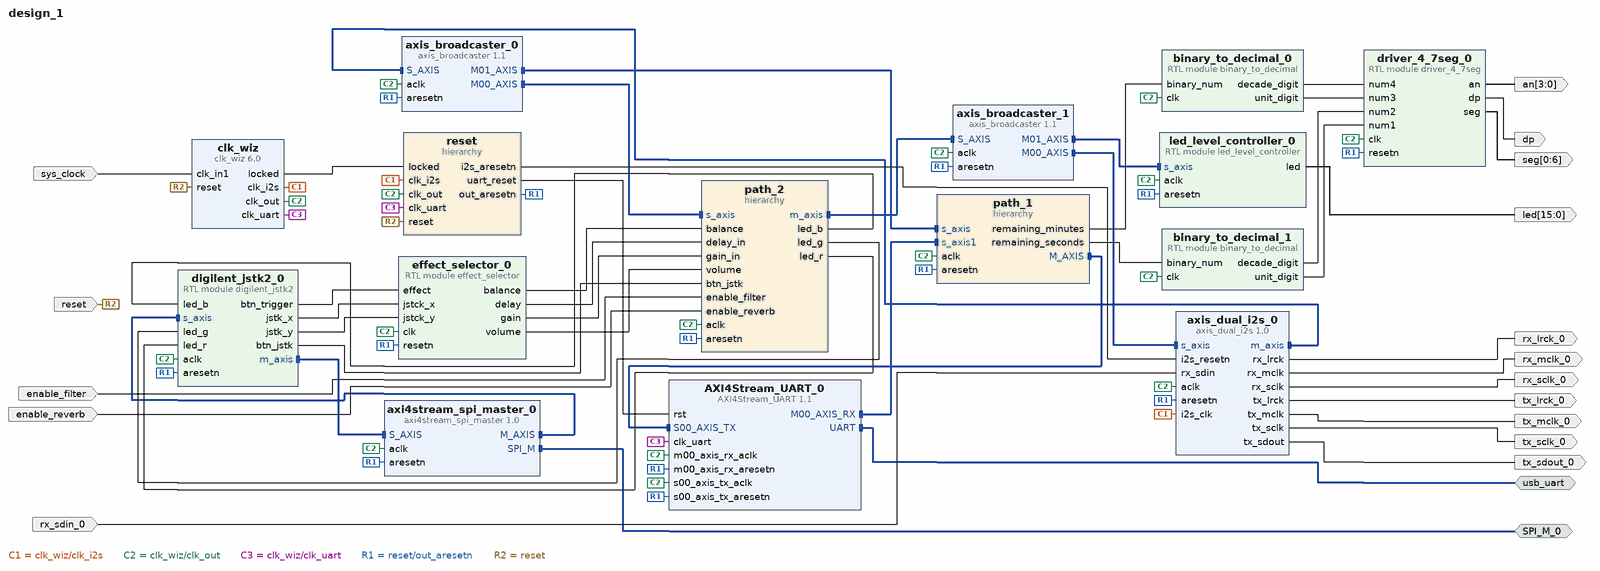
[diagram p0: block diagram of the top level]
# Vivado block design design_1, xc7a35tcpg236-1, Vivado 2020.2
create_bd_design design_1

create_bd_intf_port -mode Master -vlnv xilinx.com:interface:uart_rtl:1.0 usb_uart
create_bd_intf_port -mode Master -vlnv xilinx.com:interface:spi_rtl:1.0 SPI_M_0
create_bd_port -dir I enable_filter
create_bd_port -dir O -from 0 -to 6 seg
create_bd_port -dir O -from 3 -to 0 an
create_bd_port -dir O dp
create_bd_port -dir I enable_reverb
create_bd_port -dir O -from 15 -to 0 led
create_bd_port -dir O tx_lrck_0
create_bd_port -dir I rx_sdin_0
create_bd_port -dir O rx_sclk_0
create_bd_port -dir O rx_lrck_0
create_bd_port -dir O rx_mclk_0
create_bd_port -dir O tx_sdout_0
create_bd_port -dir O tx_sclk_0
create_bd_port -dir O tx_mclk_0
create_bd_port -dir I -type clk sys_clock
set_property -dict {CONFIG.FREQ_HZ 100000000 CONFIG.PHASE 0.000} [get_bd_ports sys_clock]
create_bd_port -dir I -type rst reset
set_property -dict {CONFIG.POLARITY ACTIVE_HIGH} [get_bd_ports reset]

create_bd_cell -type ip -vlnv DigiLAB:ip:axis_dual_i2s:1.0 axis_dual_i2s_0
create_bd_cell -type ip -vlnv xilinx.com:ip:axis_broadcaster:1.1 axis_broadcaster_1
set_property -dict [list \
  CONFIG.HAS_TKEEP 0 \
  CONFIG.HAS_TLAST 1 \
  CONFIG.HAS_TREADY 1 \
  CONFIG.HAS_TSTRB 0 \
  CONFIG.M_TDATA_NUM_BYTES 3 \
  CONFIG.M_TUSER_WIDTH 0 \
  CONFIG.S_TDATA_NUM_BYTES 3 \
  CONFIG.S_TUSER_WIDTH 0 \
  CONFIG.TDEST_WIDTH 0 \
  CONFIG.TID_WIDTH 0 \
] [get_bd_cells axis_broadcaster_1]
create_bd_cell -type module -reference led_level_controller led_level_controller_0
set_property -dict {CONFIG.clock_period_ns 5} [get_bd_cells led_level_controller_0]
create_bd_cell -type module -reference digilent_jstk2 digilent_jstk2_0
set_property -dict {CONFIG.CLKFREQ 200000000 CONFIG.SPI_SCLKFREQ 5000} [get_bd_cells digilent_jstk2_0]
create_bd_cell -type ip -vlnv DigiLAB:ip:axi4stream_spi_master:1.0 axi4stream_spi_master_0
set_property -dict {CONFIG.c_clkfreq 200000000 CONFIG.c_sclkfreq 5000} [get_bd_cells axi4stream_spi_master_0]
create_bd_cell -type module -reference effect_selector effect_selector_0
create_bd_cell -type module -reference driver_4_7seg driver_4_7seg_0
set_property -dict {CONFIG.clock_period_ns 5} [get_bd_cells driver_4_7seg_0]
create_bd_cell -type ip -vlnv xilinx.com:ip:axis_broadcaster:1.1 axis_broadcaster_0
set_property -dict [list \
  CONFIG.HAS_TKEEP 0 \
  CONFIG.HAS_TLAST 1 \
  CONFIG.HAS_TREADY 1 \
  CONFIG.HAS_TSTRB 0 \
  CONFIG.M_TDATA_NUM_BYTES 3 \
  CONFIG.M_TUSER_WIDTH 0 \
  CONFIG.S_TDATA_NUM_BYTES 3 \
  CONFIG.S_TUSER_WIDTH 0 \
  CONFIG.TDEST_WIDTH 0 \
  CONFIG.TID_WIDTH 0 \
] [get_bd_cells axis_broadcaster_0]
create_bd_cell -type hier path_2
create_bd_cell -type hier path_1
create_bd_cell -type hier reset
create_bd_cell -type ip -vlnv DigiLAB:ip:AXI4Stream_UART:1.1 AXI4Stream_UART_0
set_property -dict [list \
  CONFIG.UART_BAUD_RATE 2000000 \
  CONFIG.UART_BOARD_INTERFACE usb_uart \
  CONFIG.USE_BOARD_FLOW true \
] [get_bd_cells AXI4Stream_UART_0]
create_bd_cell -type module -reference binary_to_decimal binary_to_decimal_0
create_bd_cell -type ip -vlnv xilinx.com:ip:clk_wiz:6.0 clk_wiz
set_property -dict [list \
  CONFIG.CLKOUT1_DRIVES BUFG \
  CONFIG.CLKOUT1_JITTER 143.752 \
  CONFIG.CLKOUT1_PHASE_ERROR 98.575 \
  CONFIG.CLKOUT1_REQUESTED_OUT_FREQ 64 \
  CONFIG.CLKOUT2_DRIVES BUFG \
  CONFIG.CLKOUT2_JITTER 178.715 \
  CONFIG.CLKOUT2_PHASE_ERROR 98.575 \
  CONFIG.CLKOUT2_REQUESTED_OUT_FREQ 22.579 \
  CONFIG.CLKOUT2_USED true \
  CONFIG.CLKOUT3_DRIVES BUFG \
  CONFIG.CLKOUT3_JITTER 114.829 \
  CONFIG.CLKOUT3_PHASE_ERROR 98.575 \
  CONFIG.CLKOUT3_REQUESTED_OUT_FREQ 200 \
  CONFIG.CLKOUT3_USED true \
  CONFIG.CLKOUT4_DRIVES BUFG \
  CONFIG.CLKOUT5_DRIVES BUFG \
  CONFIG.CLKOUT6_DRIVES BUFG \
  CONFIG.CLKOUT7_DRIVES BUFG \
  CONFIG.CLK_IN1_BOARD_INTERFACE sys_clock \
  CONFIG.CLK_OUT1_PORT clk_uart \
  CONFIG.CLK_OUT2_PORT clk_i2s \
  CONFIG.CLK_OUT3_PORT clk_out \
  CONFIG.FEEDBACK_SOURCE FDBK_AUTO \
  CONFIG.MMCM_BANDWIDTH OPTIMIZED \
  CONFIG.MMCM_CLKFBOUT_MULT_F 10.000 \
  CONFIG.MMCM_CLKOUT0_DIVIDE_F 15.625 \
  CONFIG.MMCM_CLKOUT1_DIVIDE 44 \
  CONFIG.MMCM_CLKOUT2_DIVIDE 5 \
  CONFIG.MMCM_COMPENSATION ZHOLD \
  CONFIG.MMCM_DIVCLK_DIVIDE 1 \
  CONFIG.NUM_OUT_CLKS 3 \
  CONFIG.PRIMITIVE MMCM \
  CONFIG.PRIM_IN_FREQ 100.000 \
  CONFIG.RESET_BOARD_INTERFACE reset \
  CONFIG.USE_BOARD_FLOW true \
] [get_bd_cells clk_wiz]
create_bd_cell -type module -reference binary_to_decimal binary_to_decimal_1

# ---- hierarchy /path_2 ----
current_bd_instance /path_2
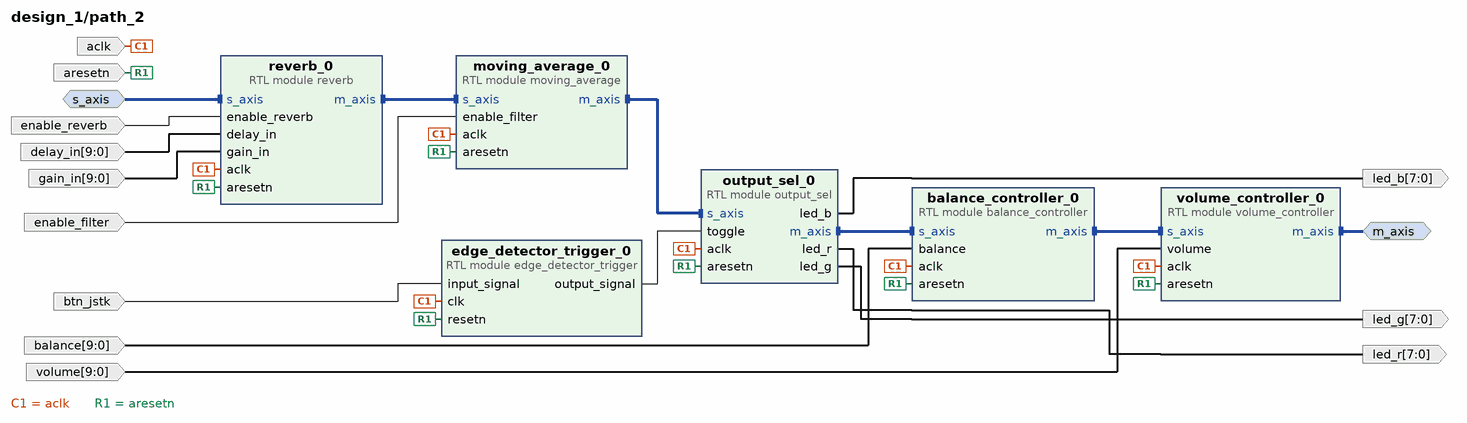
[diagram p1: block diagram inside /path_2]
create_bd_intf_pin -mode Slave -vlnv xilinx.com:interface:axis_rtl:1.0 s_axis
create_bd_intf_pin -mode Master -vlnv xilinx.com:interface:axis_rtl:1.0 m_axis
create_bd_pin -dir I enable_filter
create_bd_pin -dir I -type clk aclk
create_bd_pin -dir I -type rst aresetn
create_bd_pin -dir O -from 7 -to 0 led_r
create_bd_pin -dir O -from 7 -to 0 led_g
create_bd_pin -dir O -from 7 -to 0 led_b
create_bd_pin -dir I enable_reverb
create_bd_pin -dir I -from 9 -to 0 delay_in
create_bd_pin -dir I -from 9 -to 0 gain_in
create_bd_pin -dir I -from 9 -to 0 balance
create_bd_pin -dir I -from 9 -to 0 volume
create_bd_pin -dir I btn_jstk

create_bd_cell -type module -reference moving_average moving_average_0
create_bd_cell -type module -reference balance_controller balance_controller_0
create_bd_cell -type module -reference volume_controller volume_controller_0
set_property -dict {CONFIG.LOWER_BOUND -8388608} [get_bd_cells volume_controller_0]
create_bd_cell -type module -reference edge_detector_trigger edge_detector_trigger_0
create_bd_cell -type module -reference output_sel output_sel_0
set_property -dict {CONFIG.LOWER_BOUND -8388608} [get_bd_cells output_sel_0]
create_bd_cell -type module -reference reverb reverb_0
set_property -dict {CONFIG.LOG2_DELAY_INCR 4 CONFIG.LOWER_BOUND -8388608} [get_bd_cells reverb_0]

# ---- hierarchy /path_1 ----
current_bd_instance /path_1
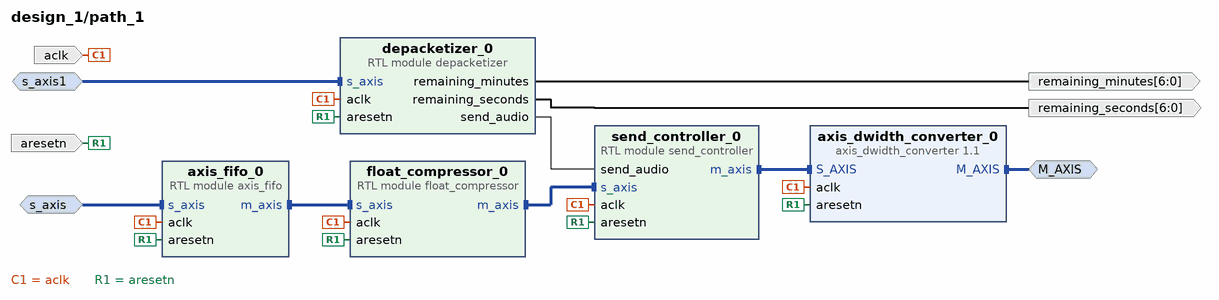
[diagram p2: block diagram inside /path_1]
create_bd_intf_pin -mode Master -vlnv xilinx.com:interface:axis_rtl:1.0 M_AXIS
create_bd_intf_pin -mode Slave -vlnv xilinx.com:interface:axis_rtl:1.0 s_axis
create_bd_intf_pin -mode Slave -vlnv xilinx.com:interface:axis_rtl:1.0 s_axis1
create_bd_pin -dir I -type clk aclk
create_bd_pin -dir I -type rst aresetn
create_bd_pin -dir O -from 6 -to 0 remaining_minutes
create_bd_pin -dir O -from 6 -to 0 remaining_seconds

create_bd_cell -type module -reference float_compressor float_compressor_0
create_bd_cell -type ip -vlnv xilinx.com:ip:axis_dwidth_converter:1.1 axis_dwidth_converter_0
set_property -dict {CONFIG.M_TDATA_NUM_BYTES 1} [get_bd_cells axis_dwidth_converter_0]
create_bd_cell -type module -reference axis_fifo axis_fifo_0
create_bd_cell -type module -reference depacketizer depacketizer_0
set_property -dict {CONFIG.CLK_FREQ_HZ 200000000} [get_bd_cells depacketizer_0]
create_bd_cell -type module -reference send_controller send_controller_0

# ---- hierarchy /reset ----
current_bd_instance /reset
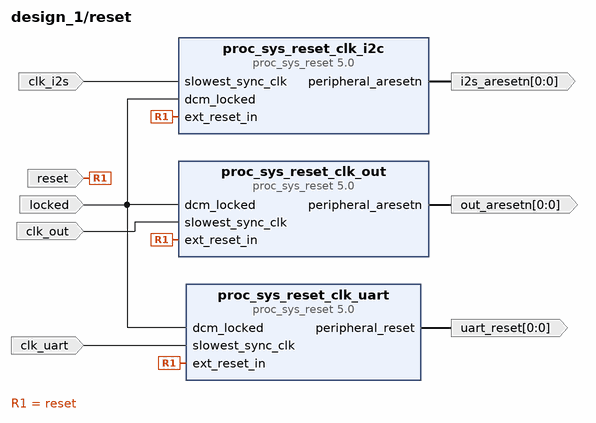
[diagram p3: block diagram inside /reset]
create_bd_pin -dir I -type clk clk_i2s
create_bd_pin -dir I -type rst reset
create_bd_pin -dir I locked
create_bd_pin -dir O -from 0 -to 0 -type rst i2s_aresetn
create_bd_pin -dir I -type clk clk_uart
create_bd_pin -dir O -from 0 -to 0 -type rst uart_reset
create_bd_pin -dir I -type clk clk_out
create_bd_pin -dir O -from 0 -to 0 -type rst out_aresetn

create_bd_cell -type ip -vlnv xilinx.com:ip:proc_sys_reset:5.0 proc_sys_reset_clk_uart
set_property -dict {CONFIG.RESET_BOARD_INTERFACE Custom CONFIG.USE_BOARD_FLOW false} [get_bd_cells proc_sys_reset_clk_uart]
create_bd_cell -type ip -vlnv xilinx.com:ip:proc_sys_reset:5.0 proc_sys_reset_clk_out
set_property -dict {CONFIG.RESET_BOARD_INTERFACE Custom CONFIG.USE_BOARD_FLOW false} [get_bd_cells proc_sys_reset_clk_out]
create_bd_cell -type ip -vlnv xilinx.com:ip:proc_sys_reset:5.0 proc_sys_reset_clk_i2c
set_property -dict {CONFIG.RESET_BOARD_INTERFACE Custom CONFIG.USE_BOARD_FLOW false} [get_bd_cells proc_sys_reset_clk_i2c]

# ---- connections ----

current_bd_instance /path_2
connect_bd_intf_net [get_bd_intf_pins balance_controller_0/m_axis] [get_bd_intf_pins volume_controller_0/s_axis]
connect_bd_intf_net [get_bd_intf_pins m_axis] [get_bd_intf_pins volume_controller_0/m_axis]
connect_bd_intf_net [get_bd_intf_pins reverb_0/m_axis] [get_bd_intf_pins moving_average_0/s_axis]
connect_bd_intf_net -intf_net split_M00_AXIS [get_bd_intf_pins s_axis] [get_bd_intf_pins reverb_0/s_axis]
connect_bd_intf_net [get_bd_intf_pins moving_average_0/m_axis] [get_bd_intf_pins output_sel_0/s_axis]
connect_bd_intf_net [get_bd_intf_pins output_sel_0/m_axis] [get_bd_intf_pins balance_controller_0/s_axis]
connect_bd_net [get_bd_pins enable_filter] [get_bd_pins moving_average_0/enable_filter]
connect_bd_net -net clk_wiz_clk_out [get_bd_pins aclk] \
  [get_bd_pins volume_controller_0/aclk] [get_bd_pins balance_controller_0/aclk] [get_bd_pins moving_average_0/aclk] \
  [get_bd_pins edge_detector_trigger_0/clk] [get_bd_pins output_sel_0/aclk] [get_bd_pins reverb_0/aclk]
connect_bd_net -net proc_sys_reset_1_peripheral_aresetn [get_bd_pins aresetn] \
  [get_bd_pins volume_controller_0/aresetn] [get_bd_pins balance_controller_0/aresetn] [get_bd_pins moving_average_0/aresetn] \
  [get_bd_pins edge_detector_trigger_0/resetn] [get_bd_pins output_sel_0/aresetn] [get_bd_pins reverb_0/aresetn]
connect_bd_net [get_bd_pins output_sel_0/led_r] [get_bd_pins led_r]
connect_bd_net [get_bd_pins output_sel_0/led_g] [get_bd_pins led_g]
connect_bd_net [get_bd_pins output_sel_0/led_b] [get_bd_pins led_b]
connect_bd_net -net enable_reverb_0_1 [get_bd_pins enable_reverb] [get_bd_pins reverb_0/enable_reverb]
connect_bd_net -net effect_selector_0_delay [get_bd_pins delay_in] [get_bd_pins reverb_0/delay_in]
connect_bd_net -net effect_selector_0_gain [get_bd_pins gain_in] [get_bd_pins reverb_0/gain_in]
connect_bd_net -net effect_selector_0_balance [get_bd_pins balance] [get_bd_pins balance_controller_0/balance]
connect_bd_net -net effect_selector_0_volume [get_bd_pins volume] [get_bd_pins volume_controller_0/volume]
connect_bd_net [get_bd_pins edge_detector_trigger_0/output_signal] [get_bd_pins output_sel_0/toggle]
connect_bd_net -net input_signal_1 [get_bd_pins btn_jstk] [get_bd_pins edge_detector_trigger_0/input_signal]

current_bd_instance /path_1
connect_bd_intf_net [get_bd_intf_pins float_compressor_0/m_axis] [get_bd_intf_pins send_controller_0/s_axis]
connect_bd_intf_net [get_bd_intf_pins send_controller_0/m_axis] [get_bd_intf_pins axis_dwidth_converter_0/S_AXIS]
connect_bd_intf_net -intf_net split_m_axis [get_bd_intf_pins float_compressor_0/s_axis] [get_bd_intf_pins axis_fifo_0/m_axis]
connect_bd_intf_net -intf_net axis_broadcaster_0_M01_AXIS [get_bd_intf_pins s_axis] [get_bd_intf_pins axis_fifo_0/s_axis]
connect_bd_intf_net -intf_net AXI4Stream_UART_0_M00_AXIS_RX [get_bd_intf_pins s_axis1] [get_bd_intf_pins depacketizer_0/s_axis]
connect_bd_intf_net [get_bd_intf_pins M_AXIS] [get_bd_intf_pins axis_dwidth_converter_0/M_AXIS]
connect_bd_net [get_bd_pins depacketizer_0/send_audio] [get_bd_pins send_controller_0/send_audio]
connect_bd_net -net clk_wiz_clk_out [get_bd_pins aclk] \
  [get_bd_pins axis_dwidth_converter_0/aclk] [get_bd_pins axis_fifo_0/aclk] [get_bd_pins float_compressor_0/aclk] \
  [get_bd_pins depacketizer_0/aclk] [get_bd_pins send_controller_0/aclk]
connect_bd_net -net proc_sys_reset_1_peripheral_aresetn [get_bd_pins aresetn] \
  [get_bd_pins axis_dwidth_converter_0/aresetn] [get_bd_pins axis_fifo_0/aresetn] [get_bd_pins float_compressor_0/aresetn] \
  [get_bd_pins depacketizer_0/aresetn] [get_bd_pins send_controller_0/aresetn]
connect_bd_net [get_bd_pins depacketizer_0/remaining_minutes] [get_bd_pins remaining_minutes]
connect_bd_net [get_bd_pins depacketizer_0/remaining_seconds] [get_bd_pins remaining_seconds]

current_bd_instance /reset
connect_bd_net -net clk_wiz_clk_i2s [get_bd_pins clk_i2s] [get_bd_pins proc_sys_reset_clk_i2c/slowest_sync_clk]
connect_bd_net [get_bd_pins reset] \
  [get_bd_pins proc_sys_reset_clk_uart/ext_reset_in] [get_bd_pins proc_sys_reset_clk_out/ext_reset_in] \
  [get_bd_pins proc_sys_reset_clk_i2c/ext_reset_in]
connect_bd_net -net clk_wiz_locked [get_bd_pins locked] \
  [get_bd_pins proc_sys_reset_clk_uart/dcm_locked] [get_bd_pins proc_sys_reset_clk_out/dcm_locked] \
  [get_bd_pins proc_sys_reset_clk_i2c/dcm_locked]
connect_bd_net -net proc_sys_reset_2_peripheral_aresetn [get_bd_pins proc_sys_reset_clk_i2c/peripheral_aresetn] [get_bd_pins i2s_aresetn]
connect_bd_net -net clk_wiz_clk_uart [get_bd_pins clk_uart] [get_bd_pins proc_sys_reset_clk_uart/slowest_sync_clk]
connect_bd_net -net proc_sys_reset_0_peripheral_reset [get_bd_pins proc_sys_reset_clk_uart/peripheral_reset] [get_bd_pins uart_reset]
connect_bd_net -net clk_wiz_clk_out [get_bd_pins clk_out] [get_bd_pins proc_sys_reset_clk_out/slowest_sync_clk]
connect_bd_net -net proc_sys_reset_1_peripheral_aresetn [get_bd_pins proc_sys_reset_clk_out/peripheral_aresetn] [get_bd_pins out_aresetn]

current_bd_instance /
connect_bd_intf_net -intf_net axis_dwidth_converter_0_M_AXIS [get_bd_intf_pins path_1/M_AXIS] [get_bd_intf_pins AXI4Stream_UART_0/S00_AXIS_TX]
connect_bd_intf_net [get_bd_intf_pins path_1/s_axis] [get_bd_intf_pins axis_broadcaster_0/M01_AXIS]
connect_bd_intf_net [get_bd_intf_pins axis_dual_i2s_0/m_axis] [get_bd_intf_pins axis_broadcaster_0/S_AXIS]
connect_bd_intf_net -intf_net split_M00_AXIS [get_bd_intf_pins path_2/s_axis] [get_bd_intf_pins axis_broadcaster_0/M00_AXIS]
connect_bd_intf_net -intf_net volume_controller_0_m_axis [get_bd_intf_pins path_2/m_axis] [get_bd_intf_pins axis_broadcaster_1/S_AXIS]
connect_bd_intf_net [get_bd_intf_pins axi4stream_spi_master_0/M_AXIS] [get_bd_intf_pins digilent_jstk2_0/s_axis]
connect_bd_intf_net [get_bd_intf_ports usb_uart] [get_bd_intf_pins AXI4Stream_UART_0/UART]
connect_bd_intf_net [get_bd_intf_pins AXI4Stream_UART_0/M00_AXIS_RX] [get_bd_intf_pins path_1/s_axis1]
connect_bd_intf_net [get_bd_intf_pins axis_broadcaster_1/M01_AXIS] [get_bd_intf_pins led_level_controller_0/s_axis]
connect_bd_intf_net [get_bd_intf_pins axi4stream_spi_master_0/S_AXIS] [get_bd_intf_pins digilent_jstk2_0/m_axis]
connect_bd_intf_net -intf_net axis_broadcaster_1_M01_AXIS [get_bd_intf_pins axis_dual_i2s_0/s_axis] [get_bd_intf_pins axis_broadcaster_1/M00_AXIS]
connect_bd_intf_net [get_bd_intf_ports SPI_M_0] [get_bd_intf_pins axi4stream_spi_master_0/SPI_M]
connect_bd_net [get_bd_pins axis_dual_i2s_0/rx_lrck] [get_bd_ports rx_lrck_0]
connect_bd_net [get_bd_pins axis_dual_i2s_0/rx_mclk] [get_bd_ports rx_mclk_0]
connect_bd_net [get_bd_pins axis_dual_i2s_0/rx_sclk] [get_bd_ports rx_sclk_0]
connect_bd_net [get_bd_pins axis_dual_i2s_0/tx_lrck] [get_bd_ports tx_lrck_0]
connect_bd_net [get_bd_pins axis_dual_i2s_0/tx_mclk] [get_bd_ports tx_mclk_0]
connect_bd_net [get_bd_pins axis_dual_i2s_0/tx_sclk] [get_bd_ports tx_sclk_0]
connect_bd_net [get_bd_pins axis_dual_i2s_0/tx_sdout] [get_bd_ports tx_sdout_0]
connect_bd_net [get_bd_pins binary_to_decimal_0/decade_digit] [get_bd_pins driver_4_7seg_0/num4]
connect_bd_net [get_bd_pins binary_to_decimal_0/unit_digit] [get_bd_pins driver_4_7seg_0/num3]
connect_bd_net [get_bd_pins binary_to_decimal_1/decade_digit] [get_bd_pins driver_4_7seg_0/num2]
connect_bd_net [get_bd_pins binary_to_decimal_1/unit_digit] [get_bd_pins driver_4_7seg_0/num1]
connect_bd_net [get_bd_pins clk_wiz/clk_i2s] [get_bd_pins axis_dual_i2s_0/i2s_clk] [get_bd_pins reset/clk_i2s]
connect_bd_net [get_bd_pins clk_wiz/clk_out] \
  [get_bd_pins axis_dual_i2s_0/aclk] [get_bd_pins axis_broadcaster_1/aclk] [get_bd_pins led_level_controller_0/aclk] \
  [get_bd_pins digilent_jstk2_0/aclk] [get_bd_pins axi4stream_spi_master_0/aclk] [get_bd_pins effect_selector_0/clk] \
  [get_bd_pins driver_4_7seg_0/clk] [get_bd_pins axis_broadcaster_0/aclk] [get_bd_pins path_2/aclk] [get_bd_pins path_1/aclk] \
  [get_bd_pins reset/clk_out] [get_bd_pins AXI4Stream_UART_0/m00_axis_rx_aclk] \
  [get_bd_pins AXI4Stream_UART_0/s00_axis_tx_aclk] [get_bd_pins binary_to_decimal_0/clk] \
  [get_bd_pins binary_to_decimal_1/clk]
connect_bd_net [get_bd_pins clk_wiz/clk_uart] [get_bd_pins reset/clk_uart] [get_bd_pins AXI4Stream_UART_0/clk_uart]
connect_bd_net [get_bd_pins clk_wiz/locked] [get_bd_pins reset/locked]
connect_bd_net -net depacketizer_0_remaining_minutes [get_bd_pins path_1/remaining_minutes] [get_bd_pins binary_to_decimal_0/binary_num]
connect_bd_net -net depacketizer_0_remaining_seconds [get_bd_pins path_1/remaining_seconds] [get_bd_pins binary_to_decimal_1/binary_num]
connect_bd_net [get_bd_pins digilent_jstk2_0/btn_trigger] [get_bd_pins effect_selector_0/effect]
connect_bd_net [get_bd_pins digilent_jstk2_0/jstk_x] [get_bd_pins effect_selector_0/jstck_x]
connect_bd_net [get_bd_pins digilent_jstk2_0/jstk_y] [get_bd_pins effect_selector_0/jstck_y]
connect_bd_net [get_bd_pins driver_4_7seg_0/an] [get_bd_ports an]
connect_bd_net [get_bd_pins driver_4_7seg_0/dp] [get_bd_ports dp]
connect_bd_net [get_bd_pins driver_4_7seg_0/seg] [get_bd_ports seg]
connect_bd_net [get_bd_pins effect_selector_0/balance] [get_bd_pins path_2/balance]
connect_bd_net [get_bd_pins effect_selector_0/delay] [get_bd_pins path_2/delay_in]
connect_bd_net [get_bd_pins effect_selector_0/gain] [get_bd_pins path_2/gain_in]
connect_bd_net [get_bd_pins effect_selector_0/volume] [get_bd_pins path_2/volume]
connect_bd_net [get_bd_ports enable_filter] [get_bd_pins path_2/enable_filter]
connect_bd_net -net enable_reverb_0_1 [get_bd_ports enable_reverb] [get_bd_pins path_2/enable_reverb]
connect_bd_net [get_bd_pins led_level_controller_0/led] [get_bd_ports led]
connect_bd_net -net output_sel_0_led_b [get_bd_pins path_2/led_b] [get_bd_pins digilent_jstk2_0/led_b]
connect_bd_net -net output_sel_0_led_g [get_bd_pins path_2/led_g] [get_bd_pins digilent_jstk2_0/led_g]
connect_bd_net -net output_sel_0_led_r [get_bd_pins path_2/led_r] [get_bd_pins digilent_jstk2_0/led_r]
connect_bd_net -net proc_sys_reset_0_peripheral_reset [get_bd_pins reset/uart_reset] [get_bd_pins AXI4Stream_UART_0/rst]
connect_bd_net -net proc_sys_reset_1_peripheral_aresetn [get_bd_pins reset/out_aresetn] \
  [get_bd_pins axis_dual_i2s_0/aresetn] [get_bd_pins axis_broadcaster_1/aresetn] [get_bd_pins led_level_controller_0/aresetn] \
  [get_bd_pins digilent_jstk2_0/aresetn] [get_bd_pins axi4stream_spi_master_0/aresetn] [get_bd_pins effect_selector_0/resetn] \
  [get_bd_pins driver_4_7seg_0/resetn] [get_bd_pins axis_broadcaster_0/aresetn] [get_bd_pins path_2/aresetn] \
  [get_bd_pins path_1/aresetn] [get_bd_pins AXI4Stream_UART_0/m00_axis_rx_aresetn] \
  [get_bd_pins AXI4Stream_UART_0/s00_axis_tx_aresetn]
connect_bd_net -net proc_sys_reset_2_peripheral_aresetn [get_bd_pins reset/i2s_aresetn] [get_bd_pins axis_dual_i2s_0/i2s_resetn]
connect_bd_net -net rx_sdin_0_1 [get_bd_ports rx_sdin_0] [get_bd_pins axis_dual_i2s_0/rx_sdin]
connect_bd_net [get_bd_ports sys_clock] [get_bd_pins clk_wiz/clk_in1]
connect_bd_net [get_bd_pins digilent_jstk2_0/btn_jstk] [get_bd_pins path_2/btn_jstk]
connect_bd_net [get_bd_ports reset] [get_bd_pins clk_wiz/reset] [get_bd_pins reset/reset]

validate_bd_design
save_bd_design
